# EAGLE schematic oswietlenie (EAGLE 8.4.0)
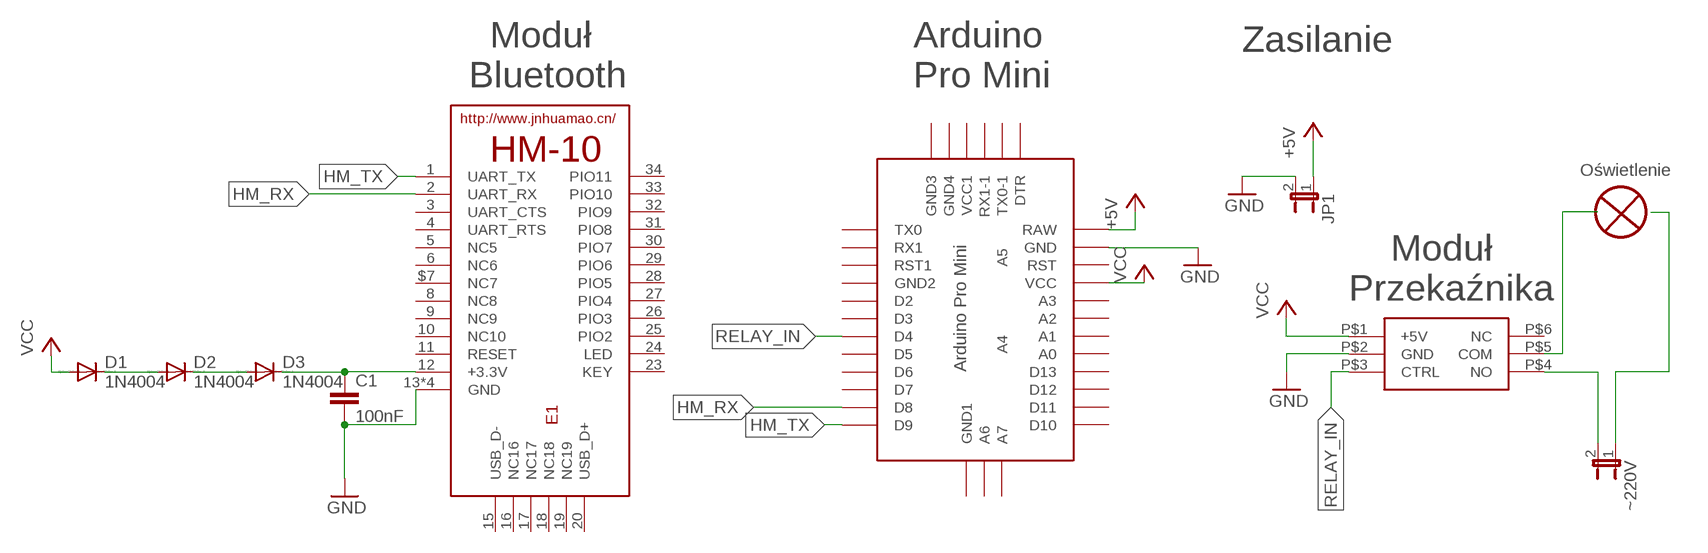
[diagram p0: schematic, sheet 1]

## Parts
C1  100nF  C-EU025-024X044  [C025-024X044]
D1  1N4004  [DO41-10]
D2  1N4004  [DO41-10]
D3  1N4004  [DO41-10]
E1  HM-10-BOARD  [26.9X13X2.2_BOARD]
JP1  JP1E  [JP1]
U$1  ABK-PRO-MINI  [ABK-PRO-MINI]
U$2  G3VM-61E1  [G3VM-61E1]
~220V  JP1E  [JP1]

## Nets
+5V: JP1.1 U$1.RAW
GND: C1.2 E1.13(GND) E1.14(GND) E1.21(GND) E1.22(GND) JP1.2 U$1.GND U$2.P$2(GND)
HM_RX: E1.2(UART_RX) U$1.D8
HM_TX: E1.1(UART_TX) U$1.D9
N$1: D1.C D2.A
N$2: U$2.P$5(COM)
N$3: U$2.P$4(NO) ~220V.2
N$4: ~220V.1
N$5: C1.1 D3.C E1.12(+3.3V)
N$6: D2.C D3.A
RELAY_IN: U$1.D4 U$2.P$3(CTRL)
VCC: D1.A U$1.VCC U$2.P$1(+5V)
Unconnected: E1.3(UART_CTS) E1.4(UART_RTS) E1.5(NC5) E1.6(NC6) E1.8(NC8) E1.9(NC9) E1.10(NC10) E1.11(RESET) E1.15(USB_D-) E1.16(NC16) E1.17(NC17) E1.18(NC18) E1.19(NC19) E1.20(USB_D+) E1.23(KEY) E1.24(LED) E1.25(PIO2) E1.26(PIO3) E1.27(PIO4) E1.28(PIO5) E1.29(PIO6) E1.30(PIO7) E1.31(PIO8) E1.32(PIO9) E1.33(PIO10) E1.34(PIO11) E1.$7(NC7) U$1.A0 U$1.A1 U$1.A2 U$1.A3 U$1.A4 U$1.A5 U$1.A6 U$1.A7 U$1.D2 U$1.D3 U$1.D5 U$1.D6 U$1.D7 U$1.D10 U$1.D11 U$1.D12 U$1.D13 U$1.DTR U$1.GND1(GND2) U$1.GND2(GND3) U$1.GND3(GND4) U$1.GND4(GND1) U$1.RST U$1.RST1 U$1.RX1 U$1.RX1-1 U$1.TX0 U$1.TX0-1 U$1.VCC1 U$2.P$6(NC)

## Notes on the sheet
- Zasilanie
- Moduł 
  Bluetooth
- Arduino
  Pro Mini
- Oświetlenie
- Moduł
  Przekaźnika

## Library data of the parts
C1 = rcl:C-EU: CAPACITOR, European symbol
D1-D3 = diode:1N4004: DIODE general purpose rectifier, 1 A
E1 = JNHuaMao:HM-10: HM Bluetooth module use TI CC2540 or CC2541, Master and slave roles in one, transmission version and remote control version and PIO state acquisition functions in one, Support the AT command modify module parameters, Convenient and flexible.
JP1 ~220V = jumper:JP1E: JUMPER
U$1 = Arduino-clone:ABK-PRO-MINI: ABK Pro-Mini Arduino Clone
U$2 = SparkFun-Retired:G3VM-61E1: Omron NO solid state relay; PROD_ID: TRANS-08720